# Altium schematic sheet Power.SchDoc
size A2; SheetNumber: 3; SheetTotal: 5
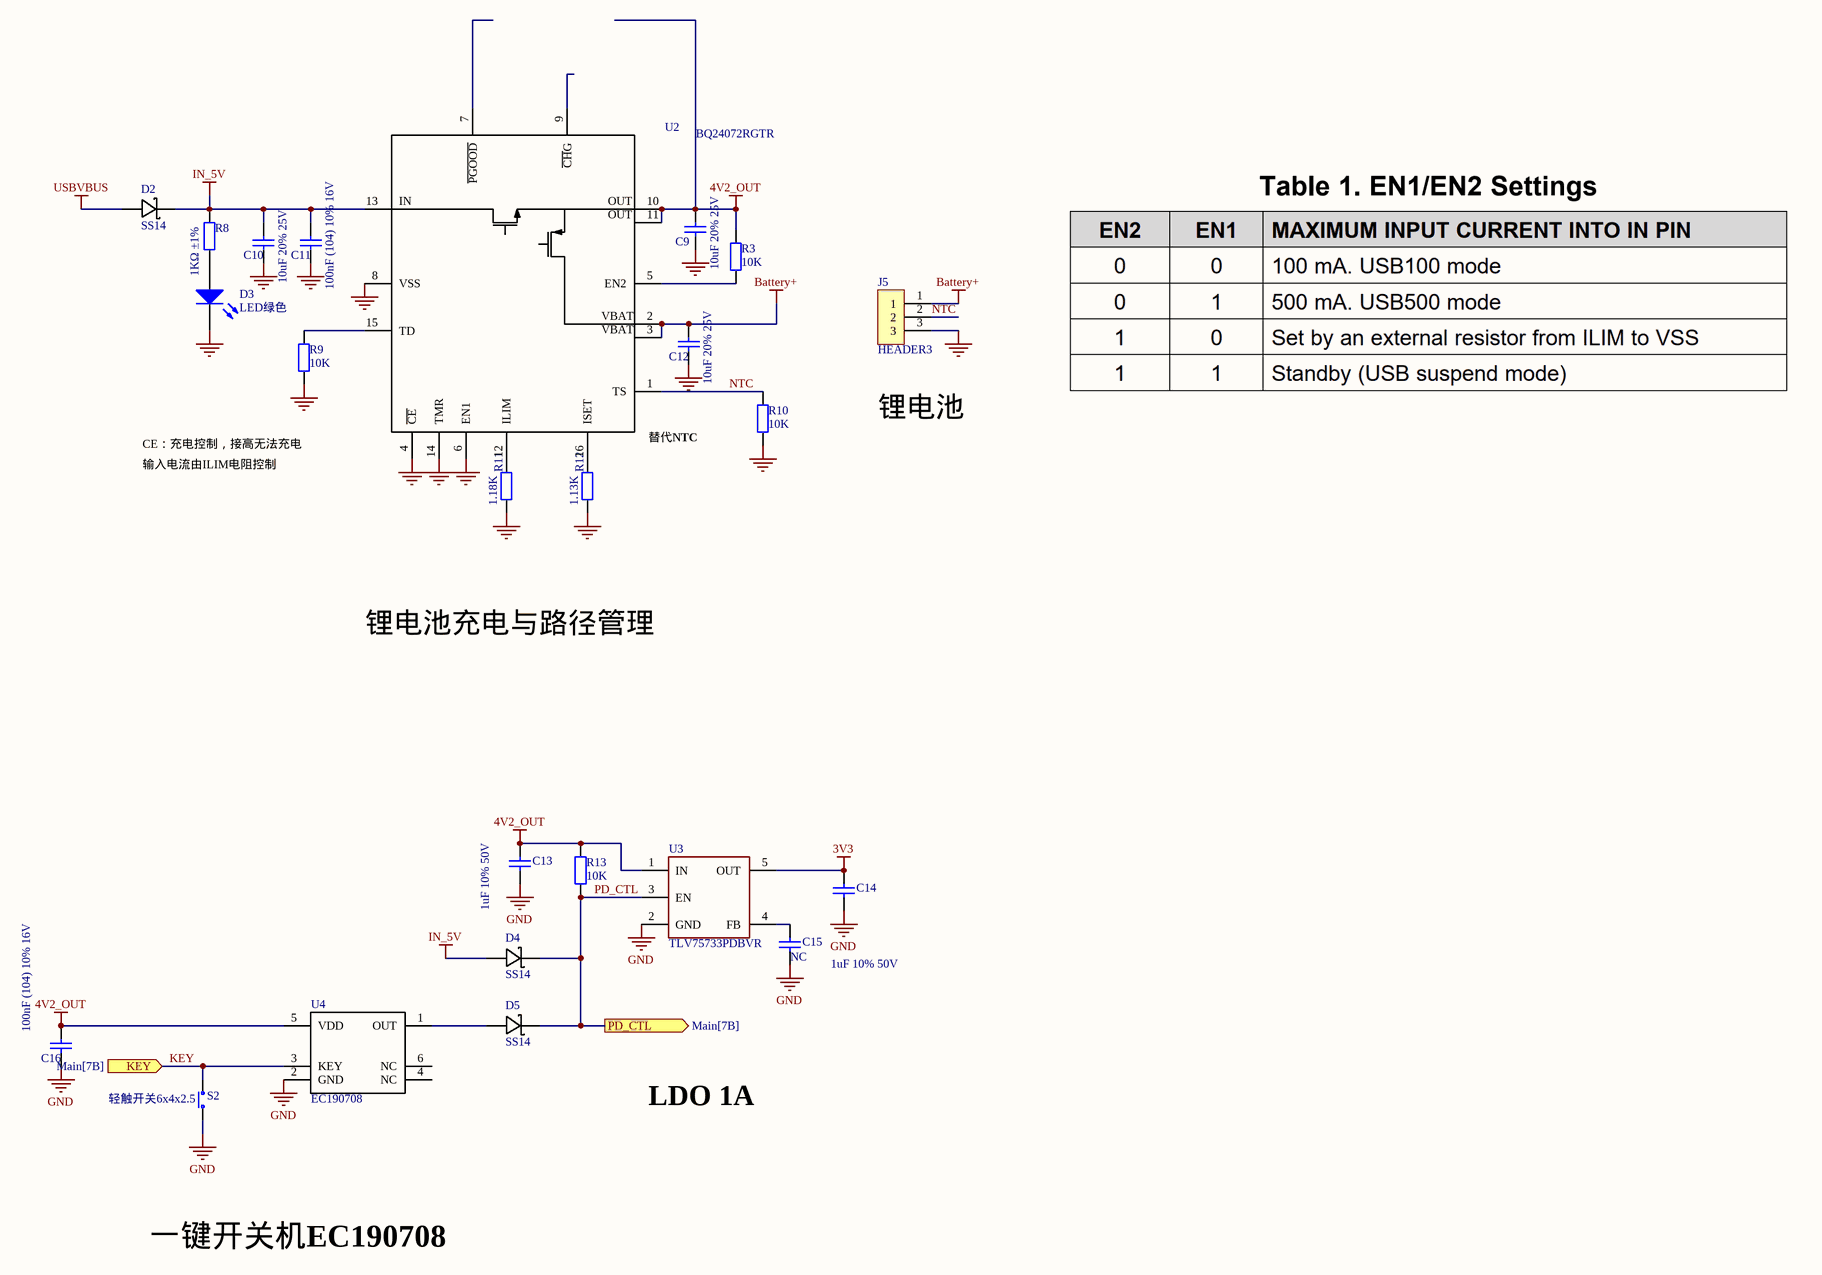
[diagram p0: Power.SchDoc]

## Parts
C9  10uF 20% 25V  [0603_C]
C10  10uF 20% 25V  [0402_C]
C11  100nF (104) 10% 16V  [0402_C]
C12  10uF 20% 25V  [0603_C]
C13  1uF 10% 50V  [0402_C]
C14  1uF 10% 50V  [0402_C]
C15  NC  [0402_C]
C16  100nF (104) 10% 16V  [0402_C]
D2  SS14  [DO-214AC]
D3  LED绿色  [LED_0402]
D4  SS14  [DO-214AC]
D5  SS14  [DO-214AC]
J5  HEADER3  [HEADER3]
R3  10K  [0402_R]
R8  1KΩ ±1%  [0402_R]
R9  10K  [0402_R]
R10  10K  [0402_R]
R11  1.18K  [0402_R]
R12  1.13K  [0402_R]
R13  10K  [0402_R]
S2  轻触开关6x4x2.5  [SW-SMD_L6.0-W4.0-LS7.2]
U2  BQ24072RGTR  [QFN-16_L3.0-W3.0-P0.50-TL-EP]
U3  TLV75733PDBVR  [SOT-23_5]
U4  EC190708  [SOT-23-6]

## Ports
KEY (in, see Main[7B]), PD_CTL (out, see Main[7B])

## Nets
3V3: C14.2 U3.5(OUT)
4V2_OUT: C9.2 C13.2 C16.2 R3.1 R13.2 U2.10(OUT) U2.11(OUT) U3.1(IN) U4.5(VDD)
Battery+: C12.2 J5.1 U2.2(BAT) U2.3(BAT)
GND: C9.1 C10.1 C11.1 C12.1 C13.1 C14.1 C15.1 C16.1 D3.K J5.3 R9.2 R10.2 R11.2 R12.2 S2.2 U2.4(~{CE}) U2.6(EN1) U2.8(VSS) U2.14(TMR) U3.2(GND) U4.2(GND)
IN_5V: C10.2 C11.2 D2.2(A) D4.1(K) R8.2 U2.13(IN)
USBVBUS: D2.1(K)
KEY: S2.1 U4.3(KEY) ; port KEY
NTC: J5.2 R10.1 U2.1(TS)
PD_CTL: D4.2(A) D5.2(A) R13.1 U3.3(EN) ; port PD_CTL
NetC15_2: C15.2 U3.4(FB)
NetD3_A: D3.A R8.1
NetD5_1: D5.1(K) U4.1(OUT)
NetR3_2: R3.2 U2.5(EN2)
NetR9_1: R9.1 U2.15(TD)
NetR11_1: R11.1 U2.12(ILIM)
NetR12_1: R12.1 U2.16(ISET)

Not connected (* = marked no-connect by the designer): U2 7(~{PGOOD}) 9(~{CH}G); U4 4(NC) 6(NC)

## Notes on the sheet
- CE：充电控制，接高无法充电
- 输入电流由ILIM电阻控制
- (near U2) 替代NTC
- 锂电池
- 锂电池充电与路径管理
- LDO 1A
- 一键开关机EC190708
- (in symbol BQ24072) VBAT

## Library data of the parts
C9 C10 C12 = 0402 10uF (106) 20% 6.3V: 贴片电容; Add into BOM: yes; Supplier: LC; SuppliersPartNumber: C15525
C11 C15 C16 = 0603 100nF (104) 10% 50V: 贴片电容; Add into BOM: yes; Supplier: LC; SuppliersPartNumber: C14663
  C15: 供应商链接: http://www.szlcsc.com/product/details_15331.html
C13 C14 = 0603 1uF (105) 10% 50V: 贴片电容; Add into BOM: yes; Supplier: LC; SuppliersPartNumber: C15849
D2 D4 D5 = SS14: 1A，40V
D3 = LED0: Typical INFRARED GaAs LED; Add into BOM: yes; 供应商链接: https://item.szlcsc.com/75457.html
R3 R8-R13 = Res2: Resistor; Add into BOM: yes; PackageReference: AXIAL-0.4; PackageDescription: Axial Device, Thru-Hole; 2 Leads; 0.4 in Pin Spacing
  R3 R9 R10 R13: Value: 10K
  R8: Value: 1KΩ ±1%
  R11: Value: 1.18K
  R12: Value: 1.13K
S2 = SW-PB_包脚U型小乌龟: Add into BOM: yes; 供应商链接: https://item.szlcsc.com/6227348.html
U2 = BQ24072: TI; Add into BOM: yes; 供应商链接: https://item.szlcsc.com/151614.html
U3 = TLV75733